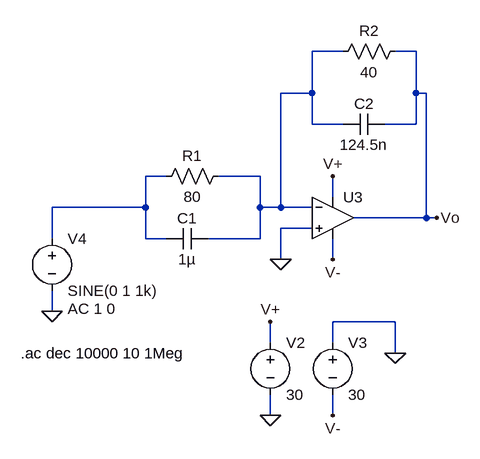
[diagram p0: schematic Ej 5.asc]
Ej 5.asc, the LTspice schematic file:
Version 4
SHEET 1 1300 680
WIRE 944 -96 896 -96
WIRE 1056 -96 1024 -96
WIRE 896 -32 896 -96
WIRE 896 -32 848 -32
WIRE 1056 -32 1056 -96
WIRE 1072 -32 1056 -32
WIRE 896 16 896 -32
WIRE 944 16 896 16
WIRE 1056 16 1056 -32
WIRE 1056 16 1008 16
WIRE 672 96 640 96
WIRE 816 96 752 96
WIRE 928 128 928 96
WIRE 640 144 640 96
WIRE 640 144 496 144
WIRE 816 144 816 96
WIRE 848 144 848 -32
WIRE 848 144 816 144
WIRE 896 144 848 144
WIRE 1072 160 1072 -32
WIRE 1072 160 960 160
WIRE 1088 160 1072 160
WIRE 896 176 848 176
WIRE 496 192 496 144
WIRE 640 192 640 144
WIRE 672 192 640 192
WIRE 816 192 816 144
WIRE 816 192 736 192
WIRE 848 224 848 176
WIRE 928 224 928 192
WIRE 496 304 496 272
WIRE 1024 320 928 320
WIRE 832 352 832 320
WIRE 928 352 928 320
WIRE 1024 368 1024 320
WIRE 832 464 832 432
WIRE 928 464 928 432
FLAG 832 464 0
FLAG 1024 368 0
FLAG 832 320 V+
FLAG 928 464 V-
FLAG 848 224 0
FLAG 496 304 0
FLAG 1088 160 Vo
FLAG 928 96 V+
FLAG 928 224 V-
SYMBOL voltage 832 336 R0
WINDOW 123 0 0 Left 0
WINDOW 39 0 0 Left 0
SYMATTR InstName V2
SYMATTR Value 30
SYMBOL voltage 928 336 R0
WINDOW 123 0 0 Left 0
WINDOW 39 0 0 Left 0
SYMATTR InstName V3
SYMATTR Value 30
SYMBOL cap 736 176 R90
WINDOW 0 0 32 VBottom 2
WINDOW 3 32 32 VTop 2
SYMATTR InstName C1
SYMATTR Value 1µ
SYMBOL cap 1008 0 R90
WINDOW 0 0 32 VBottom 2
WINDOW 3 32 32 VTop 2
SYMATTR InstName C2
SYMATTR Value 124.5n
SYMBOL res 1040 -112 R90
WINDOW 0 0 56 VBottom 2
WINDOW 3 32 56 VTop 2
SYMATTR InstName R2
SYMATTR Value 40
SYMBOL res 768 80 R90
WINDOW 0 0 56 VBottom 2
WINDOW 3 32 56 VTop 2
SYMATTR InstName R1
SYMATTR Value 80
SYMBOL voltage 496 176 R0
WINDOW 123 24 124 Left 2
WINDOW 39 0 0 Left 0
SYMATTR InstName V4
SYMATTR Value SINE(0 1 1k)
SYMATTR Value2 AC 1 0
SYMBOL OpAmps\\UniversalOpAmp 928 160 R0
SYMATTR InstName U3
SYMATTR Value2 Avol=10000000Meg GBW=100000000Meg Vos=0
SYMATTR SpiceLine En=0 Enk=0 In=0 Ink=0 Rin=5000000000Meg
TEXT 448 368 Left 2 !.ac dec 10000 10 1Meg

The netlist it stands for:
* Ej 5.asc
V2 V+ 0 30
V3 0 V- 30
C1 N001 N002 1µ
C2 Vo N001 124.5n
R2 Vo N001 40
R1 N001 N002 80
V4 N002 0 SINE(0 1 1k) AC 1 0
XU3 0 N001 V+ V- Vo level1 Avol=10000000Meg GBW=100000000Meg Vos=0 En=0 Enk=0 In=0 Ink=0 Rin=5000000000Meg  ; pins In+ In- V+ V- OUT
.ac dec 10000 10 1Meg
.lib UniversalOpAmp1.lib
.backanno
.end